# Altium schematic sheet Sheet5.SchDoc
size A4; SheetNumber: 5; SheetTotal: 6
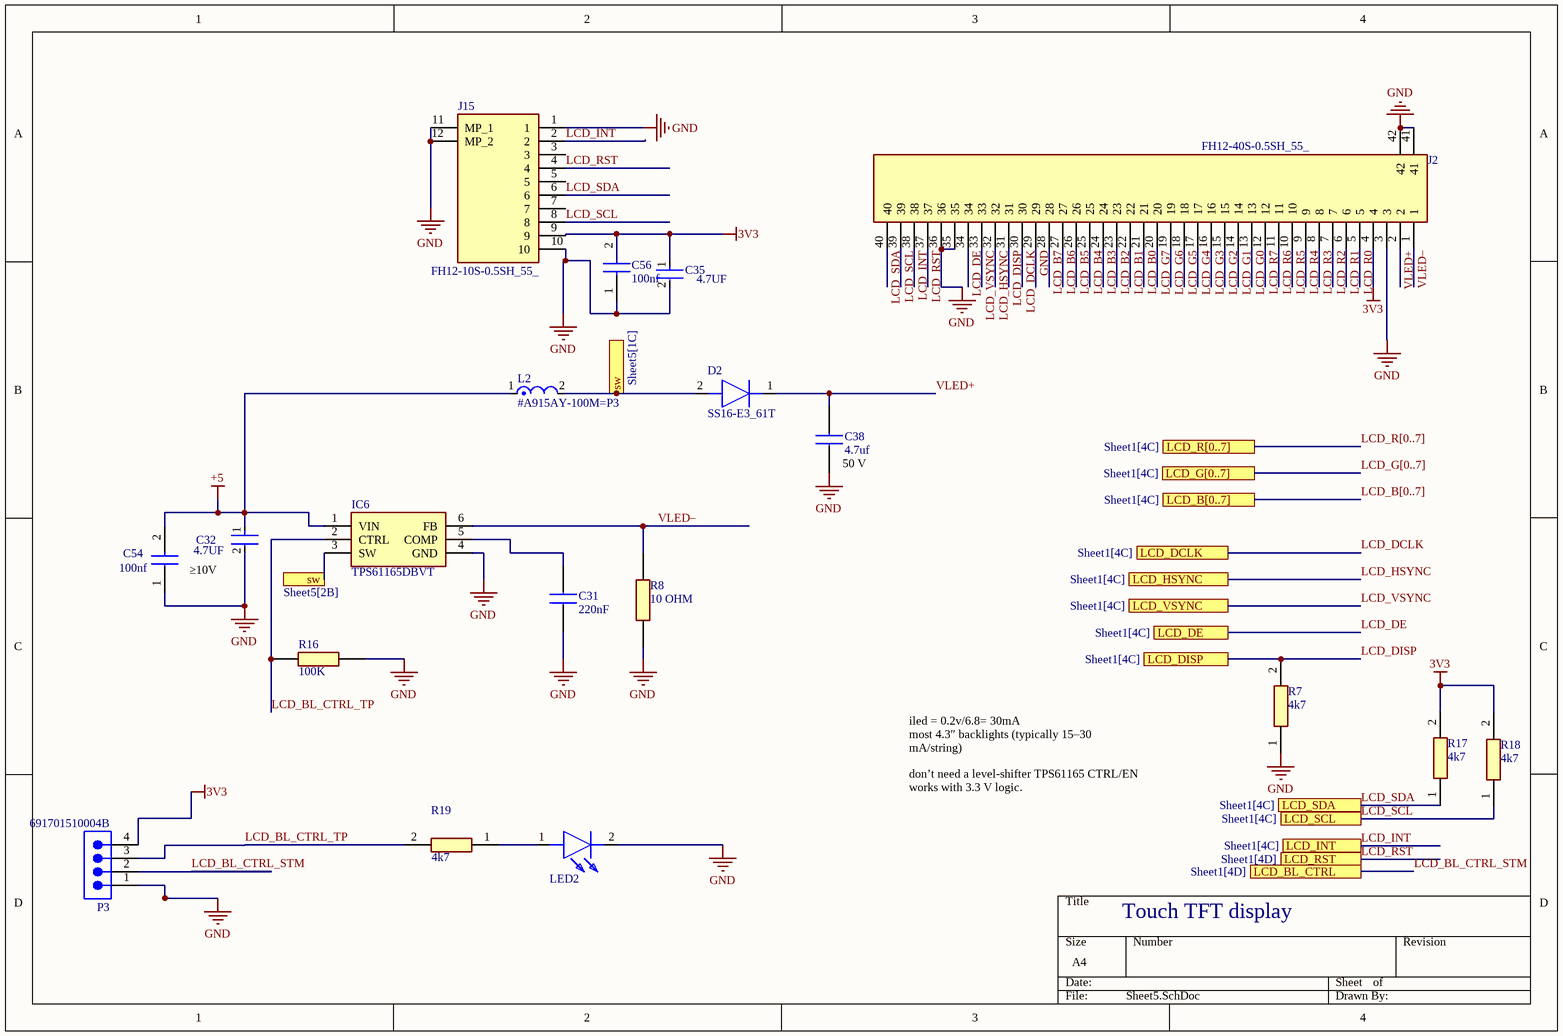
[diagram p0: Sheet5.SchDoc]

## Parts
C31  220nF  [CAPC1608X87N]
C32  4.7UF  [FP-CL10-IPC_A]
C35  4.7UF  [FP-CL10-IPC_A]
C38  4.7uf  [CAPC1608X95N]
C54  100nf  [CAPC1608X95N]
C56  100nf  [CAPC1608X95N]
D2  SS16-E3_61T  [DIOM5127X229N]
IC6  TPS61165DBVT  [SOT95P280X145-6N]
J2  FH12-40S-0.5SH_55_  [FH1240S05SH55]
J15  FH12-10S-0.5SH_55_  [FH1210S05SH55]
L2  #A915AY-100M=P3  [FP-D53LC-MFG]
LED2  KPTL-3216SURCK-01-VS  [KPTL3216SURCK01VS]  (value not drawn)
P3  691701510004B  [691701510004B]
R7  4k7  [RESC1608X55N]
R8  10 OHM  [RESC1608X50N]
R16  100K  [RESC1608X50N]
R17  4k7  [RESC1608X55N]
R18  4k7  [RESC1608X55N]
R19  4k7  [RESC1608X55N]

## Ports
LCD_B[0..7] (see Sheet1[4C]), LCD_BL_CTRL (see Sheet1[4D]), LCD_DCLK (see Sheet1[4C]), LCD_DE (see Sheet1[4C]), LCD_DISP (see Sheet1[4C]), LCD_G[0..7] (see Sheet1[4C]), LCD_HSYNC (see Sheet1[4C]), LCD_INT (see Sheet1[4C]), LCD_R[0..7] (see Sheet1[4C]), LCD_RST (see Sheet1[4D]), LCD_SCL (see Sheet1[4C]), LCD_SDA (see Sheet1[4C]), LCD_VSYNC (see Sheet1[4C]), sw (see Sheet5[1C]), sw (see Sheet5[2B])

## Nets
3V3: C35.1 C56.2 J2.4 J15.9 P3.4 R17.2 R18.2
+5: C32.1 C54.2 IC6.1(VIN) L2.1
GND: C31.1 C32.2 C35.2 C38.1 C54.1 C56.1 IC6.4(GND) J2.3 J2.29 J2.35 J2.36 J2.41 J2.42 J15.1 J15.10 J15.11(MP_1) J15.12(MP_2) LED2.2(K) P3.1 R7.1 R8.1 R16.2
LCD_B0: J2.21
LCD_B1: J2.22
LCD_B2: J2.23
LCD_B3: J2.24
LCD_B4: J2.25
LCD_B5: J2.26
LCD_B6: J2.27
LCD_B7: J2.28
LCD_BL_CTRL_STM: P3.2 ; port LCD_BL_CTRL
LCD_BL_CTRL_TP: IC6.2(CTRL) P3.3 R16.1 R19.2
LCD_DCLK: J2.30 ; port LCD_DCLK
LCD_DE: J2.34 ; port LCD_DE
LCD_DISP: J2.31 R7.2 ; port LCD_DISP
LCD_G0: J2.13
LCD_G1: J2.14
LCD_G2: J2.15
LCD_G3: J2.16
LCD_G4: J2.17
LCD_G5: J2.18
LCD_G6: J2.19
LCD_G7: J2.20
LCD_HSYNC: J2.32 ; port LCD_HSYNC
LCD_INT: J2.38 J15.2 ; port LCD_INT
LCD_R0: J2.5
LCD_R1: J2.6
LCD_R2: J2.7
LCD_R3: J2.8
LCD_R4: J2.9
LCD_R5: J2.10
LCD_R6: J2.11
LCD_R7: J2.12
LCD_RST: J2.37 J15.4 ; port LCD_RST
LCD_SCL: J2.39 J15.8 R18.1 ; port LCD_SCL
LCD_SDA: J2.40 J15.6 R17.1 ; port LCD_SDA
LCD_VSYNC: J2.33 ; port LCD_VSYNC
sw: D2.2(A) IC6.3(SW) L2.2 ; port sw
VLED+: C38.2 D2.1(K) J2.2
VLED–: IC6.6(FB) J2.1 R8.2
NetC31_2: C31.2 IC6.5(COMP)
NetLED2_1: LED2.1(A) R19.1

Not connected (* = marked no-connect by the designer): J15 3 5 7

## Buses and harness runs
bus LCD_B[0..7] = port LCD_B[0..7]
bus LCD_G[0..7] = port LCD_G[0..7]
bus LCD_R[0..7] = port LCD_R[0..7]

## Notes on the sheet
- (near C38) 50 V
- ≥10V
- iled = 0.2v/6.8= 30mA                                most 4.3″ backlights (typically 15–30 mA/string)
- don’t need a level-shifter TPS61165 CTRL/EN works with 3.3 V logic.
- Touch TFT display

## Library data of the parts
C31 = 0603B223K500CT: WALSIN - 0603B223K500CT - CAPACITOR, MLCC, X7R, 0.022UF, 50V, 0603; Manufacturer_Name: Walsin Technology Corporation; Geometry.Height: 0.87mm; Manufacturer_Part_Number: 0603B223K500CT; Mouser Part Number: 791-0603B223K500CT; Mouser Price/Stock: https://www.mouser.co.uk/ProductDetail/Walsin/0603B223K500CT?qs=fIkAfuXiAQLm86jiyfZMMQ%3D%3D; Arrow Part Number: 0603B223K500CT; Arrow Price/Stock: https://www.arrow.com/en/products/0603b223k500ct/walsin-technology; Datasheet Link: https://componentsearchengine.com/Datasheets/2/0603B223K500CT.pdf
C32 C35 = CMP-13271-003582-1: Cap Ceramic 2.2uF 10V X7R ±10% Pad SMD 0603 +125°C T/R; Max Operating Temperature: 125°C; Package Quantity: 1; Thickness: 0.035inch; Capacitance: 2.2uF; Height: 0.8mm; Case/Package: 0603; Case Code (Metric): 1608; Radiation Hardening: No; Dielectric: X7R; Mount: Surface Mount; Contact Plating: Tin; Material: Ceramic; Length: 1.6mm; Packaging: Tape and Reel; Width: 0.031inch; Min Operating Temperature: -55°C; Case Code (Imperial): 0603; Depth: 0.8mm; Voltage Rating: 10V; Tolerance: 10%
C38 = 0603X105K250CT: WALSIN - 0603X105K250CT - SMD Multilayer Ceramic Capacitor, 1 F, 25 V, 0603 [1608 Metric], +/- 10%, X5R; Manufacturer_Name: Walsin Technology Corporation; Geometry.Height: 0.95mm; Manufacturer_Part_Number: 0603X105K250CT; Mouser Part Number: *; Mouser Price/Stock: *; Arrow Part Number: *; Arrow Price/Stock: *; Datasheet Link: https://g.componentsearchengine.com/Datasheets/2/0603X105K250CT.pdf
C54 C56 = VJ0603Y104KXACW1BC: Capacitor; Manufacturer_Name: Vishay; Datasheet Link: https://componentsearchengine.com/Datasheets/2/VJ0603Y104KXACW1BC.pdf; Height: 0.95mm; Manufacturer_Part_Number: VJ0603Y104KXACW1BC; Mouser Part Number: N/A; Mouser Price/Stock: https://www.mouser.co.uk/ProductDetail/Vishay-Vitramon/VJ0603Y104KXACW1BC?qs=M%2FcR%2FDpCXFVPJpohemA31Q%3D%3D; Arrow Part Number: VJ0603Y104KXACW1BC; Arrow Price/Stock: https://www.arrow.com/en/products/vj0603y104kxacw1bc/vishay?utm_currency=USD&region=nac
D2 = SS16-E3_61T: Diode; Manufacturer_Name: Vishay; Manufacturer_Part_Number: SS16-E3/61T; Datasheet Link: https://componentsearchengine.com/Datasheets/2/SS16-E3_61T.pdf; Height: 2.29mm; Mouser Part Number: 625-SS16-E3; Mouser Price/Stock: https://www.mouser.co.uk/ProductDetail/Vishay-General-Semiconductor/SS16-E3-61T?qs=x2jpVgRnAtMiLlJLdPGu3w%3D%3D; Arrow Part Number: SS16-E3/61T; Arrow Price/Stock: https://www.arrow.com/en/products/ss16-e361t/vishay?utm_currency=USD&region=europe
IC6 = TPS61165DBVT: Integrated Circuit; Manufacturer_Name: Texas Instruments; Datasheet Link: http://www.ti.com/lit/gpn/tps61165; Height: 1.45mm; Manufacturer_Part_Number: TPS61165DBVT; Mouser Part Number: 595-TPS61165DBVT; Mouser Price/Stock: https://www.mouser.co.uk/ProductDetail/Texas-Instruments/TPS61165DBVT?qs=HM7Ob9npyBILp76tdVJPyQ%3D%3D; Arrow Part Number: TPS61165DBVT; Arrow Price/Stock: https://www.arrow.com/en/products/tps61165dbvt/texas-instruments?utm_currency=USD&region=nac
J2 = FH12-40S-0.5SH_55_: Connector; Manufacturer_Name: Hirose; Manufacturer_Part_Number: FH12-40S-0.5SH(55); Datasheet Link: https://datasheet.datasheetarchive.com/originals/distributors/SFDatasheet-1/sf-00023459.pdf; Height: 2mm; Mouser Part Number: 798-FH12-40S-0.5SH55; Mouser Price/Stock: https://www.mouser.co.uk/ProductDetail/Hirose-Connector/FH12-40S-0.5SH55?qs=Ux3WWAnHpjCB5TtHwQqTgA%3D%3D; Arrow Part Number: FH12-40S-0.5SH(55); Arrow Price/Stock: https://www.arrow.com/en/products/fh12-40s-0.5sh-55/hirose-electric
J15 = FH12-10S-0.5SH_55_: Connector; Manufacturer_Name: Hirose; Manufacturer_Part_Number: FH12-10S-0.5SH(55); Datasheet Link: https://www.mouser.com/datasheet/3/731/1/FH12_10S_0.5SH_55__CL0586_0522_3_55_2DDrawing_0000987484.pdf; Height: 2.2mm; Mouser Part Number: 798-FH12-10S-0.5SH55; Mouser Price/Stock: https://www.mouser.co.uk/ProductDetail/Hirose-Connector/FH12-10S-0.5SH55?qs=Ux3WWAnHpjDbjH5OXeBUGQ%3D%3D; Arrow Part Number: FH12-10S-0.5SH(55); Arrow Price/Stock: null?utm_currency=USD&region=nac
L2 = CMP-06042-000140-1: FIXED IND 10UH 1.49A 90 MOHM SMD; Tolerance: 20%; Case/Package: 2020; Length: 5.2mm
LED2 = KPTL-3216SURCK-01-VS: LED; Manufacturer_Name: Kingbright; Datasheet Link: http://www.farnell.com/datasheets/1655872.pdf; Height: 1.2mm; Manufacturer_Part_Number: KPTL-3216SURCK-01-VS; Mouser Part Number: N/A; Mouser Price/Stock: https://www.mouser.co.uk/ProductDetail/Kingbright/KPTL-3216SURCK-01-VS?qs=5DWHFlm3M2sATWsF9Oia%2FA%3D%3D
P3 = CMP-1502-02331-3: Terminal Block, 5.08MM, Close Vertical Pcb Header, Thr Type, 4 Pins; Number of Contacts: 4; Voltage Rating: 300V; Current Rating: 10A; Gender: Male; Contact Material: Brass; Number of Pins: 4; REACH SVHC: Unknown; Lead Pitch: 5.08mm; Connector Type: Terminal Block; Max Operating Temperature: 105°C; Min Operating Temperature: -40°C; Housing Material: Polymer; Contact Plating: Tin; Mount: Through Hole; RoHS: Compliant; Color: Black; Pitch: 5.08mm; Length: 23.12mm; Termination: PCB
R7 R17-R19 = CRCW06034K70JNEAC: Resistor; Manufacturer_Name: Vishay; Datasheet Link: http://www.vishay.com/docs/28773/crcwce3.pdf; Height: 0.55mm; Manufacturer_Part_Number: CRCW06034K70JNEAC; Mouser Part Number: 71-CRCW06034K70JNEAC; Mouser Price/Stock: https://www.mouser.co.uk/ProductDetail/Vishay-Dale/CRCW06034K70JNEAC?qs=E3Y5ESvWgWMzBuUf0K3dnA%3D%3D; Arrow Part Number: CRCW06034K70JNEAC; Arrow Price/Stock: https://www.arrow.com/en/products/crcw06034k70jneac/vishay?region=nac
R8 = RCA0603100KFKEA: AR03BTCX6R80; Manufacturer_Name: Vishay; Geometry.Height: 0.5mm; Manufacturer_Part_Number: RCA0603100KFKEA; Mouser Part Number: 71-RCA0603100KFKEA; Mouser Price/Stock: https://www.mouser.com/Search/Refine.aspx?Keyword=71-RCA0603100KFKEA; Arrow Part Number: RCA0603100KFKEA; Arrow Price/Stock: https://www.arrow.com/en/products/rca0603100kfkea/vishay?utm_currency=USD&region=nac; Datasheet Link: https://www.vishay.com/docs/20037/rcae3.pdf
R16 = RCA0603100KFKEA: 100 kOhms +/-1% 0.1W, 1/10W Chip Resistor 0603 (1608 Metric) Anti-Sulfur, Automotive AEC-Q200 Thick Film; Manufacturer_Name: Vishay; Geometry.Height: 0.5mm; Manufacturer_Part_Number: RCA0603100KFKEA; Mouser Part Number: 71-RCA0603100KFKEA; Mouser Price/Stock: https://www.mouser.com/Search/Refine.aspx?Keyword=71-RCA0603100KFKEA; Arrow Part Number: RCA0603100KFKEA; Arrow Price/Stock: https://www.arrow.com/en/products/rca0603100kfkea/vishay?utm_currency=USD&region=nac; Datasheet Link: https://www.vishay.com/docs/20037/rcae3.pdf